# Altium schematic sheet IO_Connectors.SchDoc
size A4; DocumentNumber: 6; SheetNumber: 6; SheetTotal: 9
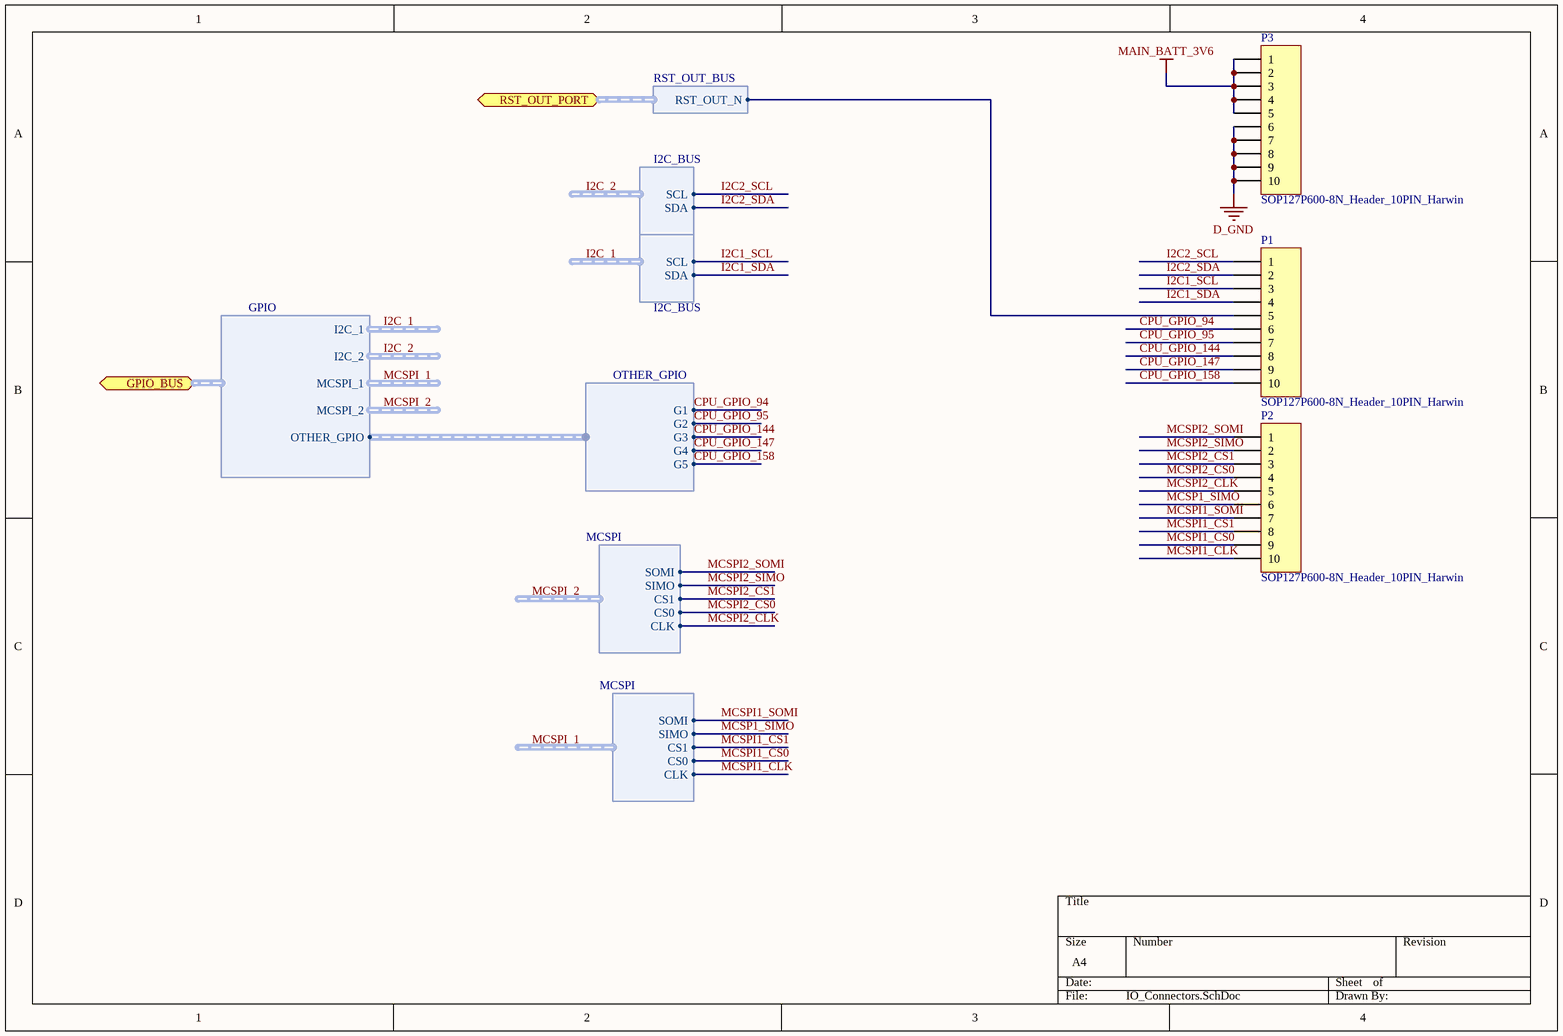
[diagram p0: IO_Connectors.SchDoc]

## Parts
P1  SOP127P600-8N_Header_10PIN_Harwin  [SOP127P600-8N_Header_10PIN_Harwin]
P2  SOP127P600-8N_Header_10PIN_Harwin  [SOP127P600-8N_Header_10PIN_Harwin]
P3  SOP127P600-8N_Header_10PIN_Harwin  [SOP127P600-8N_Header_10PIN_Harwin]

## Ports
GPIO_BUS (harness GPIO), RST_OUT_PORT (harness RST_OUT_BUS)

## Harnesses
OTHER_GPIO: G1, G2, G3, G4, G5
I2C_BUS: SDA, SCL
MCSPI: CLK, CS0, CS1, SIMO, SOMI
GPIO: I2C_1, I2C_2, MCSPI_1, MCSPI_2, OTHER_GPIO
RST_OUT_BUS: RST_OUT_N

## Nets
D_GND: P3.6 P3.7 P3.8 P3.9 P3.10
MAIN_BATT_3V6: P3.1 P3.2 P3.3 P3.4 P3.5
CPU_GPIO_94: P1.6 ; harness OTHER_GPIO.G1
CPU_GPIO_95: P1.7 ; harness OTHER_GPIO.G2
CPU_GPIO_144: P1.8 ; harness OTHER_GPIO.G3
CPU_GPIO_147: P1.9 ; harness OTHER_GPIO.G4
CPU_GPIO_158: P1.10 ; harness OTHER_GPIO.G5
I2C1_SCL: P1.3 ; harness I2C_BUS.SCL
I2C1_SDA: P1.4 ; harness I2C_BUS.SDA
I2C2_SCL: P1.1 ; harness I2C_BUS.SCL
I2C2_SDA: P1.2 ; harness I2C_BUS.SDA
MCSP1_SIMO: P2.6 ; harness MCSPI.SIMO
MCSPI1_CLK: P2.10 ; harness MCSPI.CLK
MCSPI1_CS0: P2.9 ; harness MCSPI.CS0
MCSPI1_CS1: P2.8 ; harness MCSPI.CS1
MCSPI1_SOMI: P2.7 ; harness MCSPI.SOMI
MCSPI2_CLK: P2.5 ; harness MCSPI.CLK
MCSPI2_CS0: P2.4 ; harness MCSPI.CS0
MCSPI2_CS1: P2.3 ; harness MCSPI.CS1
MCSPI2_SIMO: P2.2 ; harness MCSPI.SIMO
MCSPI2_SOMI: P2.1 ; harness MCSPI.SOMI
NetP1_5: P1.5 ; port RST_OUT_PORT.RST_OUT_N

## Library data of the parts
P1-P3 = Header 10: Header, 10-Pin; LatestRevisionDate: 17-Jul-2002; LatestRevisionNote: Re-released for DXP Platform.; Publisher: Altium Limited